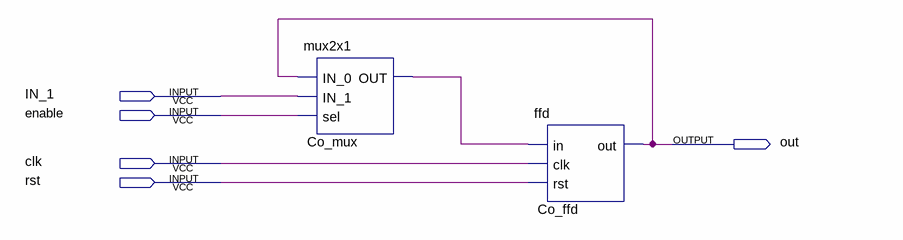
[diagram p0: schematic sheet]
// Quartus schematic block.bdf as structural Verilog: 2 symbols, 5 pins
module block (
  input  IN_1,
  input  enable,
  input  clk,
  input  rst,
  output out
);

  wire Co_mux_out;

  mux2x1 Co_mux (.IN_0(out), .IN_1(IN_1), .sel(enable), .OUT(Co_mux_out));
  ffd Co_ffd (.in(Co_mux_out), .clk(clk), .rst(rst), .out(out));
endmodule
